# Altium schematic sheet 4_PowerSupplie.SchDoc
size 414 x 293 mm; SheetNumber: 4; SheetTotal: 4; PageSetup: Record=PageOptionsZCenterHorizontal=TrueZCenterVertical=TrueZPrintScale=1.00ZXCorrection=0.00ZYCorrection=0.00ZPrintKind=1ZBorderSize=5000000ZLeftOffset=0ZBottomOffset=0ZOrientation=2ZPaperLength=1000ZPaperWidth=1000ZScale=100ZPaperSource=7ZPrintQuality=-4ZMediaType=1ZDitherType=10ZPaperKind=A3ZPrintScaleMode=0; Razrabotal: {Разработал}; Proveril: {Проверил}; Tkontr: {Т.контр.}; Nkontr: {Н.контр.}; Ytverdil: {Утвердил}; Nazvanie1: {Название1}; Nazvanie2: {Название2}; Oboznachenie: {Обозначение}
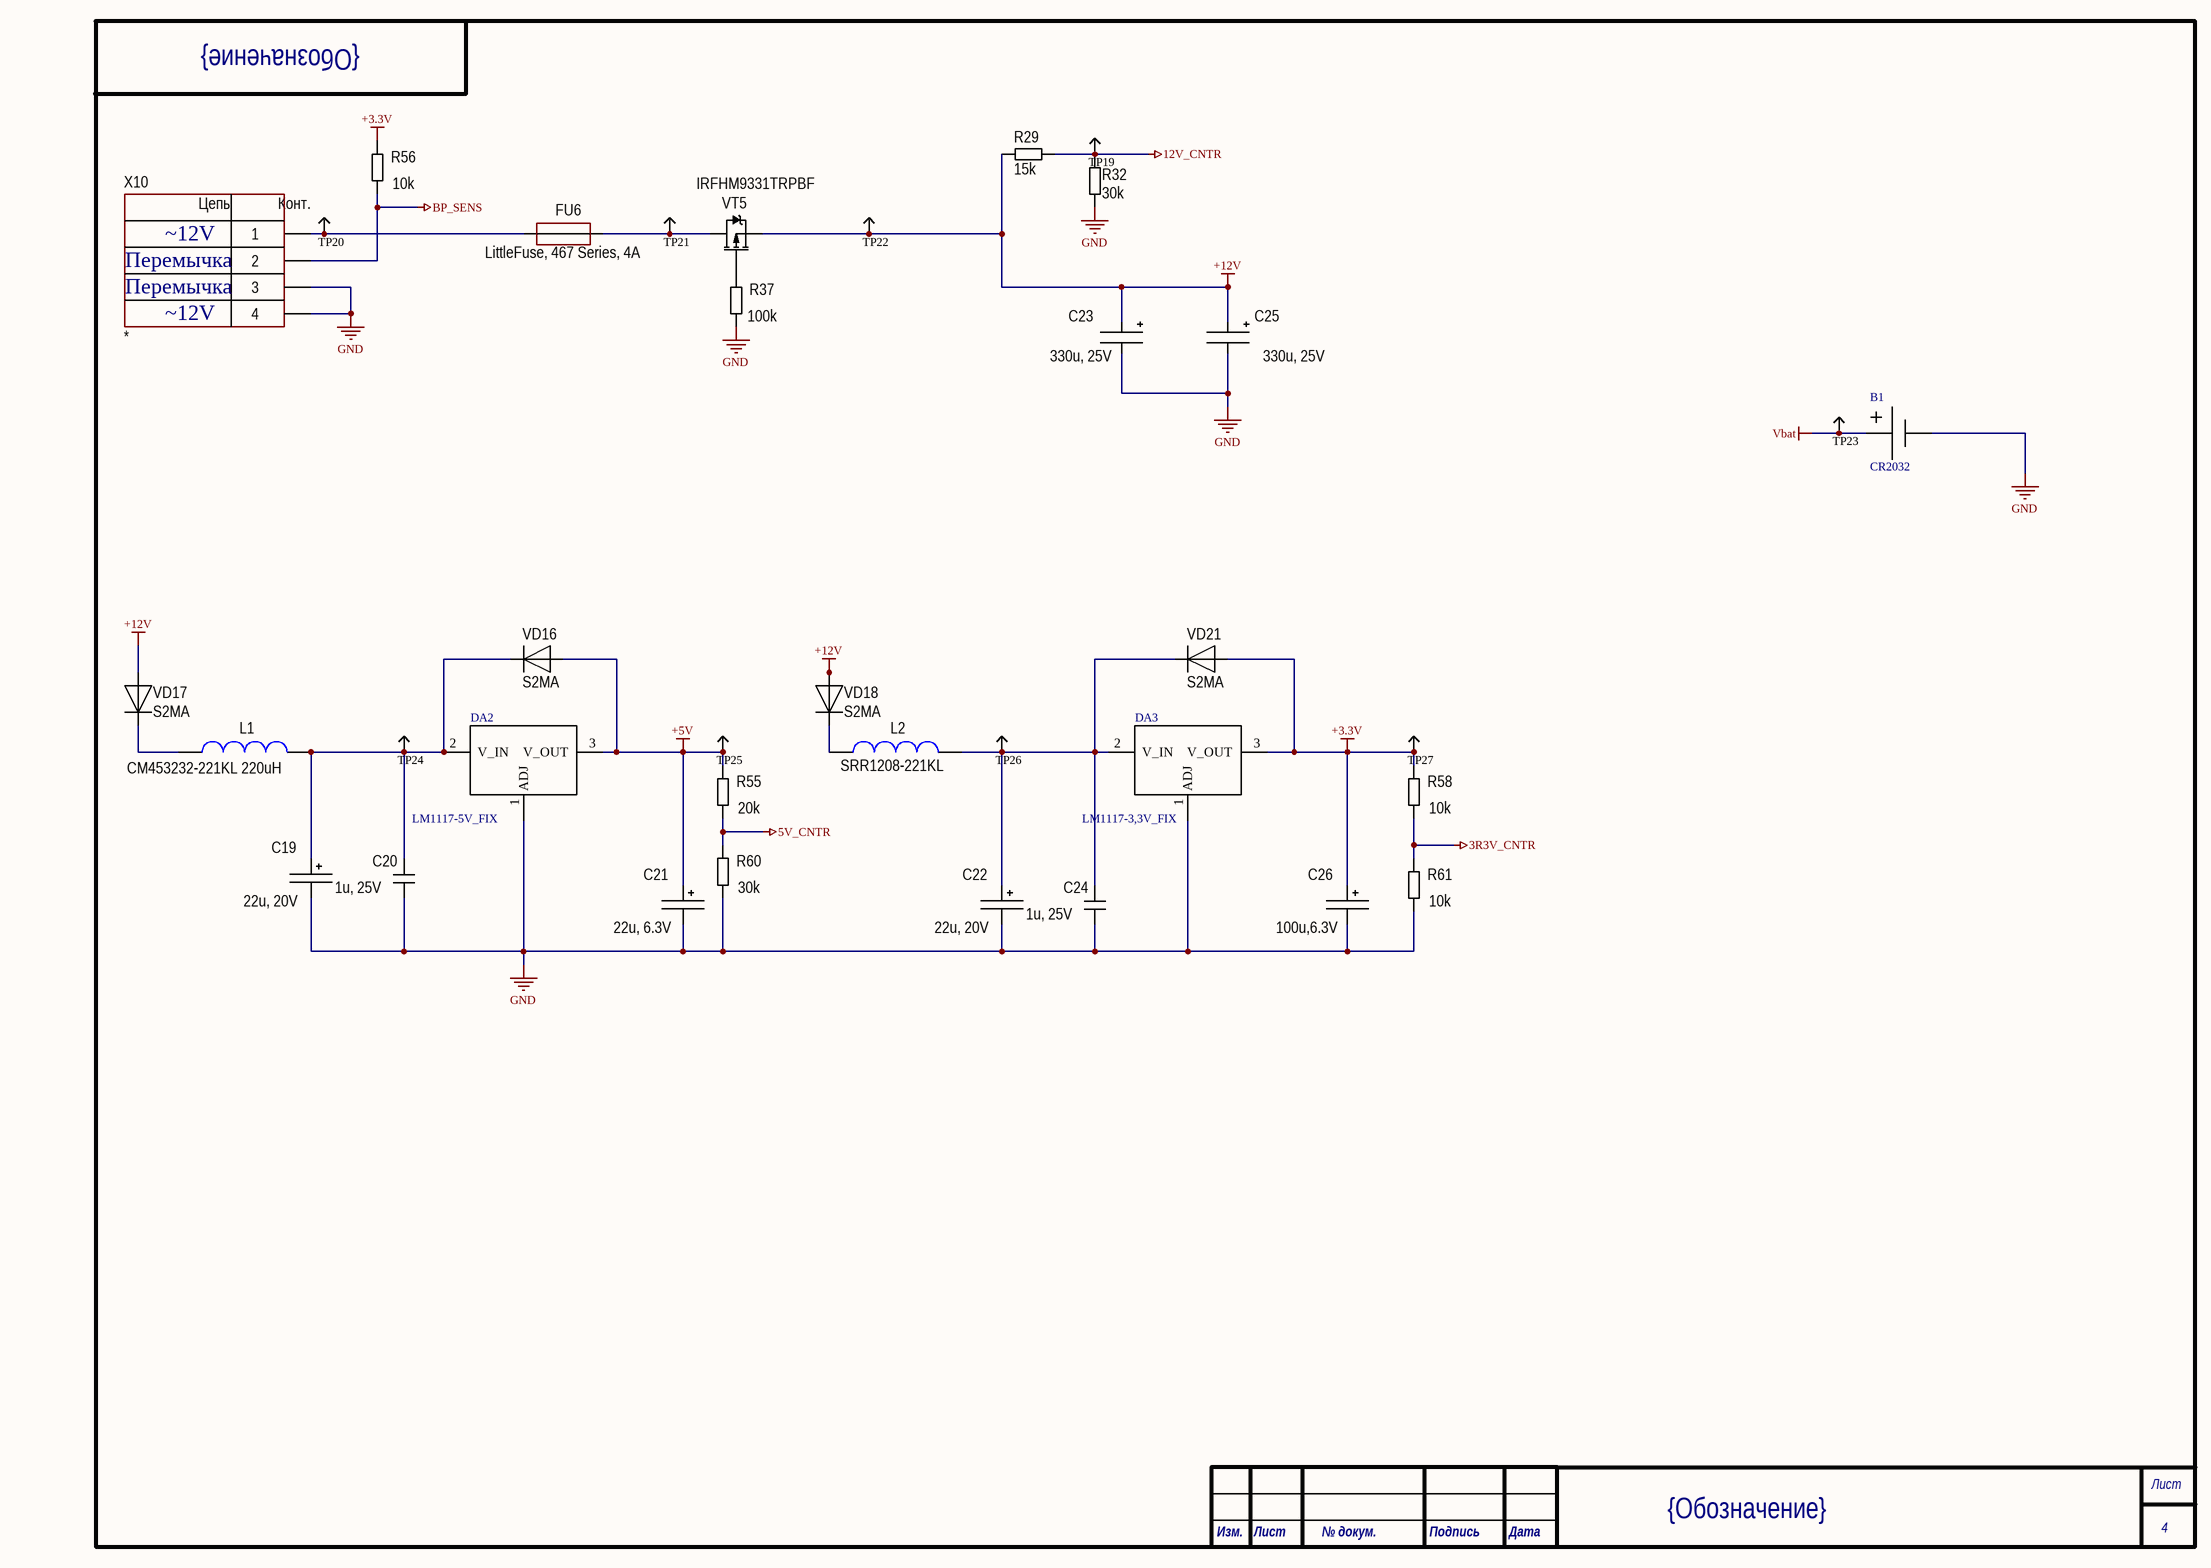
[diagram p0: 4_PowerSupplie.SchDoc]

## Parts
B1  CR2032  [CR2032]
C19  22u, 20V  [TANTAL_B]
C20  1u, 25V  [CH0805C]
C21  22u, 6.3V  [TANTAL_B]
C22  22u, 20V  [TANTAL_B]
C23  330u, 25V  [D10C4.4H10]
C24  1u, 25V  [CH0805C]
C25  330u, 25V  [D10C4.4H10]
C26  100u,6.3V  [TANTAL_B]
DA2  LM1117-5V_FIX  [SOT223_123]
DA3  LM1117-3,3V_FIX  [SOT223_123]
FU6  LittleFuse, 467 Series, 4A  [CH0603F]
L1  CM453232-221KL 220uH  [IND:1812]
L2  SRR1208-221KL  [IND: SRR1208]
R29  15k  [CH0603R]
R32  30k  [CH0603R]
R37  100k  [CH0603R]
R55  20k  [CH0603R]
R56  10k  [CH0603R]
R58  10k  [CH0603R]
R60  30k  [CH0603R]
R61  10k  [CH0603R]
TP19  (no value)  [TestPoint]
TP20  (no value)  [TestPoint]
TP21  (no value)  [TestPoint]
TP22  (no value)  [TestPoint]
TP23  (no value)  [TestPoint]
TP24  (no value)  [TestPoint]
TP25  (no value)  [TestPoint]
TP26  (no value)  [TestPoint]
TP27  (no value)  [TestPoint]
VD16  S2MA  [SMA]
VD17  S2MA  [SMA]
VD18  S2MA  [SMA]
VD21  S2MA  [SMA]
VT5  IRFHM9331TRPBF  [PQFN-5x6]
X10  *  [CON: CWF-4]

## Nets
3R3V_CNTR: R58.1 R61.2
5V_CNTR: R55.1 R60.2
12V_CNTR: R29.1 R32.2 TP19.0
+3.3V: C26.1 DA3.3(V_OUT) R56.2 R58.2 TP27.0 VD21.1
+5V: C21.1 DA2.3(V_OUT) R55.2 TP25.0 VD16.1
+12V: C23.1 C25.1 R29.2 TP22.0 VD17.1 VD18.1 VT5.3(S)
BP_SENS: R56.1 X10.2
GND: B1.2 C19.2 C20.1 C21.2 C22.2 C23.2 C24.1 C25.2 C26.2 DA2.1(ADJ) DA3.1(ADJ) R32.1 R37.1 R60.1 R61.1 X10.3 X10.4
Vbat: B1.1 TP23.0
NetC19_1: C19.1 C20.2 DA2.2(V_IN) L1.1 TP24.0 VD16.2
NetC22_1: C22.1 C24.2 DA3.2(V_IN) L2.1 TP26.0 VD21.2
NetFU6_1: FU6.1 TP20.0 X10.1
NetFU6_2: FU6.2 TP21.0 VT5.2(D)
NetL1_2: L1.2 VD17.2
NetL2_2: L2.2 VD18.2
NetR37_2: R37.2 VT5.1(G)

## Notes on the sheet
- Перемычка
- ~12V
- Лист
- Изм.
- № докум.
- Подпись
- Дата
- (in symbol 4-Connector) Цепь; Конт.

## Library data of the parts
B1 = Battery_CR2032
C19 C21 C22 C26 = TantalCap: Manufacturer: *; Model: *; HelpURL: *; ComponentKind: *; Value: *
C20 C24 = Capacitor: Manufacturer: *; Model: *; HelpURL: *; ComponentKind: *; Value: *
C23 C25 = AlumCap: Manufacturer: *; Model: *; HelpURL: *; ComponentKind: *; Value: *
DA2 DA3 = LM1117
FU6 = Fuse: Manufacturer: *; Model: *; HelpURL: *; ComponentKind: *; Value: *
L1 L2 = Inductor: Manufacturer: *; Model: *; HelpURL: *; ComponentKind: *; Value: *
R29 R32 R37 R55 R56 R58 R60 R61 = Resistor: Manufacturer: *; Model: *; HelpURL: *; ComponentKind: *; Value: *
TP19-TP27 = TestPoint
VD16-VD18 VD21 = Diod: ComponentKind: *; Manufacturer: *; Model: *; HelpURL: *
VT5 = P-chanel: Mosfet; Model: *; Manufacturer: *; ComponentKind: *; HelpURL: *
X10 = 4-Connector: Model: *; Manufacturer: *; HelpURL: *; ComponentKind: *